# EAGLE design Röle Modülü Çift (EAGLE 9.6.2)
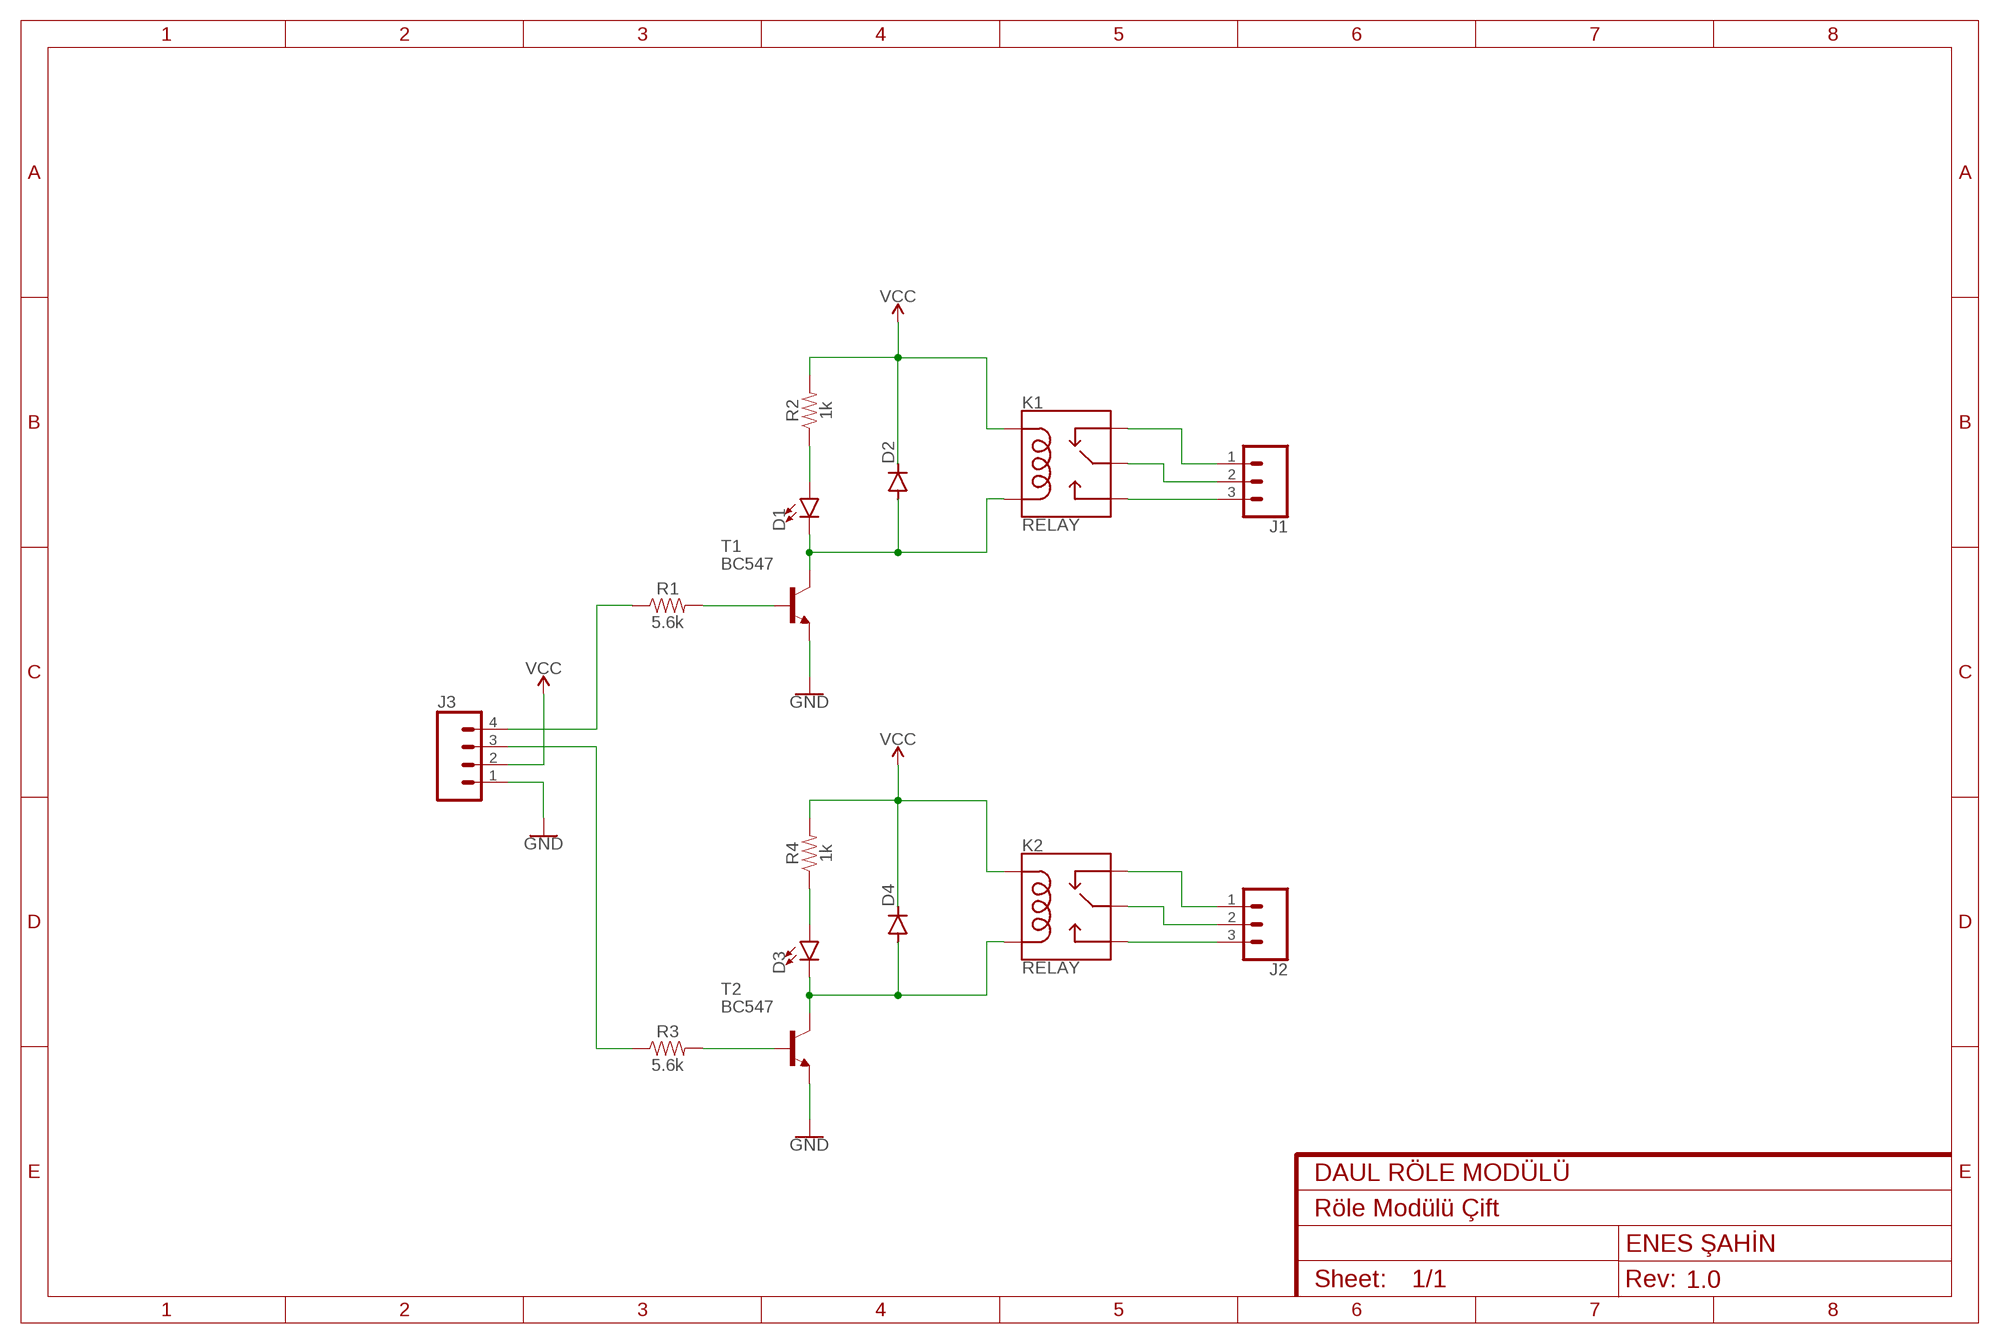
[diagram p0: schematic, sheet 1]
FRAME1 (FRAME-A4L): CNAME: DAUL RÖLE MODÜLÜ; CREVISION: 1.0; DESIGNER: ENES ŞAHİN

## Parts
D1  LED3MM  [LED_3MM]
D2  DIODE-DO07  [DO07]
D3  LED3MM  [LED_3MM]
D4  DIODE-DO07  [DO07]
J1  CONN_03  [1X03]
J2  CONN_03  [1X03]
J3  CONN_04  [1X04]
K1  RELAY  RELAY-SPDT-JZC-11F  [RELAY-JZC]
K2  RELAY  RELAY-SPDT-JZC-11F  [RELAY-JZC]
R1  5.6k  1KOHM-HORIZ-1/4W-1%  [AXIAL-0.3]
R2  1k  1KOHM-HORIZ-1/4W-1%  [AXIAL-0.3]
R3  5.6k  1KOHM-HORIZ-1/4W-1%  [AXIAL-0.3]
R4  1k  1KOHM-HORIZ-1/4W-1%  [AXIAL-0.3]
T1  BC547  [TO92]
T2  BC547  [TO92]

## Nets
GND: J3.1 T1.1(E) T2.1(E)
N$1: R1.P$2 T1.2(B)
N$2: D1.K(C) D2.A K1.1(COIL2) T1.3(C)
N$3: D1.A R2.P$1
N$4: R3.P$2 T2.2(B)
N$5: J3.4 R1.P$1
N$6: D3.K(C) D4.A K2.1(COIL2) T2.3(C)
N$7: J1.1 K1.2(NC)
N$8: J1.2 K1.4(MAIN)
N$9: J1.3 K1.3(NO)
N$10: D3.A R4.P$1
N$11: J3.3 R3.P$1
N$12: J2.1 K2.2(NC)
N$13: J2.2 K2.4(MAIN)
N$14: J2.3 K2.3(NO)
VCC: D2.C D4.C J3.2 K1.5(COIL1) K2.5(COIL1) R2.P$2 R4.P$2

## Library data of the parts
D1 D3 = SparkFun-LED1:LED: LED (Generic) Standard schematic elements and footprints for 5mm, 3mm, 1206, and 0603 sized LEDs. Generic LEDs with no color specified.; PROD_ID: DIO-08794
D2 D4 = diode:DIODE-: DIODE
J1 J2 = SparkFun-Connectors:CONN_03: Multi connection point. Often used as Generic Header-pin footprint for 0.1 inch spaced/style header connections On any of the 0.1 inch spaced packages, you can populate with these: Break Away Headers - Straight <https://www.sparkfun.com/products/116> (PRT-00116) Break Away Male Headers - Right Angle <https://www.sparkfun.com/products/553> (PRT-00553) Female Headers <https://www.sparkfun.com/products/115> (PRT-00115) Break Away Headers - Machine Pin <https://www.sparkfun.com/products/117> (PRT-00117) Break Away Female Headers - Swiss Machine Pin <https://www.sparkfun.com/products/743> (PRT-00743) Stackable Header - 3 Pin (Female, 0.1") <https://www.sparkfun.com/products/13875> (PRT-13875) For SCREWTERMINALS and SPRING TERMINALS visit here: Screw Terimnals on SparkFun.com <https://www.sparkfun.com/search/results?term=Screw+Terminals> (5mm/3.5mm/2.54mm spacing) This device is also useful as a general connection point to wire up your design to another part of your project. Our various solder wires solder well into these plated through hole pads. Hook-Up Wire - Assortment (Stranded, 22 AWG) <https://www.sparkfun.com/products/11375> (PRT-11375) Hook-Up Wire - Assortment (Solid Core, 22 AWG) <https://www.sparkfun.com/products/11367> (PRT-11367) View the entire wire category on our website here <https://www.sparkfun.com/categories/141> Special notes: Molex polarized connector foot print use with SKU : PRT-08232 with associated crimp pins and housings.
J3 = SparkFun-Connectors:CONN_04: Multi connection point. Often used as Generic Header-pin footprint for 0.1 inch spaced/style header connections On any of the 0.1 inch spaced packages, you can populate with these: Break Away Headers - Straight <https://www.sparkfun.com/products/116> (PRT-00116) Break Away Male Headers - Right Angle <https://www.sparkfun.com/products/553> (PRT-00553) Female Headers <https://www.sparkfun.com/products/115> (PRT-00115) Break Away Headers - Machine Pin <https://www.sparkfun.com/products/117> (PRT-00117) Break Away Female Headers - Swiss Machine Pin <https://www.sparkfun.com/products/743> (PRT-00743) For SCREWTERMINALS and SPRING TERMINALS visit here: Screw Terimnals on SparkFun.com <https://www.sparkfun.com/search/results?term=Screw+Terminals> (5mm/3.5mm/2.54mm spacing) This device is also useful as a general connection point to wire up your design to another part of your project. Our various solder wires solder well into these plated through hole pads. Hook-Up Wire - Assortment (Stranded, 22 AWG) <https://www.sparkfun.com/products/11375> (PRT-11375) Hook-Up Wire - Assortment (Solid Core, 22 AWG) <https://www.sparkfun.com/products/11367> (PRT-11367) View the entire wire category on our website here <https://www.sparkfun.com/categories/141> Special notes: Molex polarized connector foot print use with SKU : PRT-08231 with associated crimp pins and housings. 1MM SMD Version SKU: PRT-10208; PROD_ID: CONN-09696
K1 K2 = SparkFun-Electromechanical:RELAY-SPDT: SPDT Electromechanical Relay Single-pole, double-throw sealed relays. When current is applied to the coil, it throws a simple changeover switch, terminating the connection from the NC contact to ground and closing the NO contact. Use them to switch high voltage/high current devices. SparkFun Products JQX-15F: Relay SPDT Sealed - 20A <https://www.sparkfun.com/products/10924> (COM-10924) JZC-11F: Relay SPDT Sealed <https://www.sparkfun.com/products/100> (COM-00100); PROD_ID: COMP-09533; SF_SKU: COM-00100
R1 R3 = SparkFun-Resistors1:1KOHM: 1kΩ resistor A resistor is a passive two-terminal electrical component that implements electrical resistance as a circuit element. Resistors act to reduce current flow, and, at the same time, act to lower voltage levels within circuits. - Wikipedia; PROD_ID: RES-12182; VALUE: 1k
R2 R4 = SparkFun-Resistors1:1KOHM: 1kΩ resistor A resistor is a passive two-terminal electrical component that implements electrical resistance as a circuit element. Resistors act to reduce current flow, and, at the same time, act to lower voltage levels within circuits. - Wikipedia; PROD_ID: RES-12182
T1 T2 = transistor:BC547: NPN TRANSISTOR

## Board
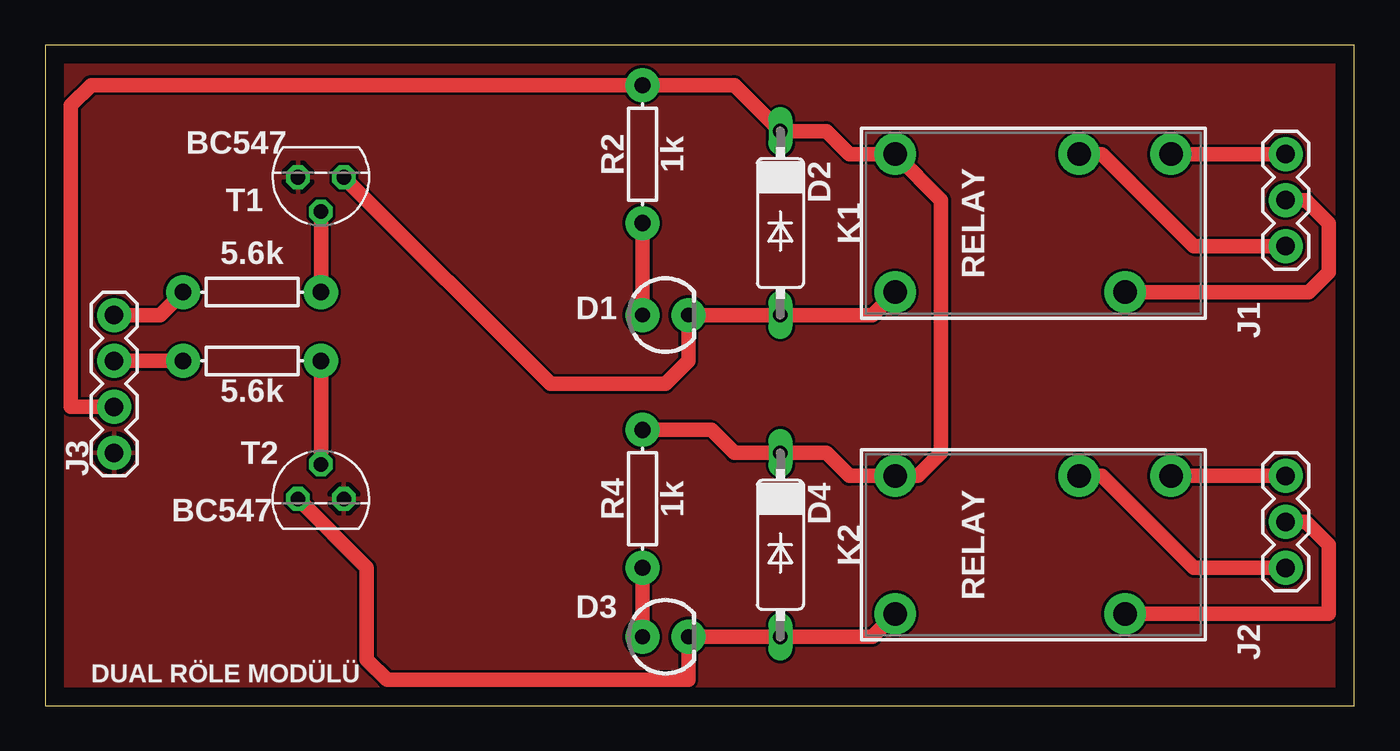
[diagram p1: board, top side]
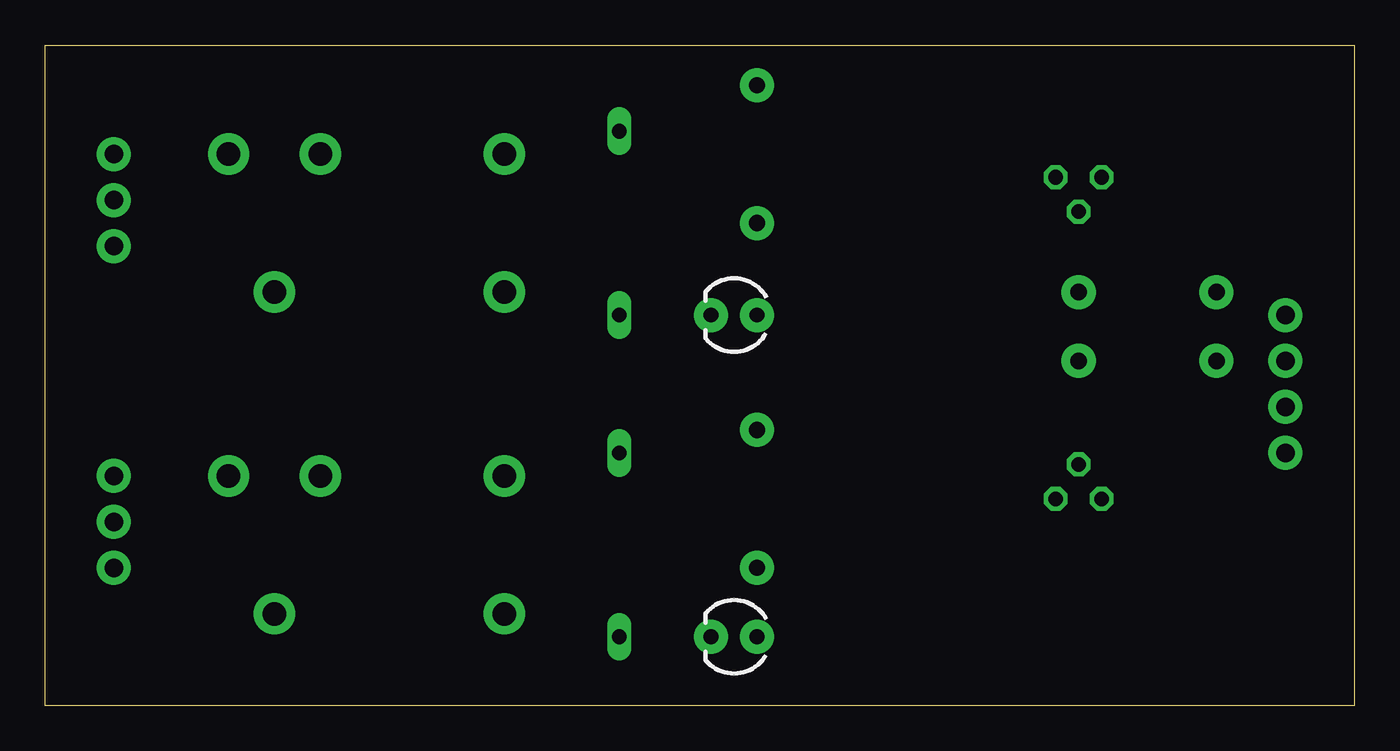
[diagram p2: board, bottom side, seen from below]

Size 72.37 x 36.5 mm. Coordinates in mm from the lower left corner, seen from the top.
Outline: 0,0 72.37,0 72.37,36.5 0,36.5 0,0
Copper layers (1*16): Top 0.035mm / dielectric 1.5mm / Bottom 0.035mm
Design rules "default": minimum track width 6mil, minimum drill 0.35mm, track to track 6mil, track to pad 6mil, pad to pad 6mil, via to via 6mil, smd to smd 6mil, copper to edge 40mil, drill to drill 6mil, minimum pad ring 10mil, minimum via ring 8mil, stop-mask expansion 4mil, vias tented up to drill 0mil, thermal gap 10mil

### Footprints (pad centres in the part's own frame; a part is rotated, then mirrored left to right if it is on the bottom)
LED_3MM = drill 0.813 pad 1.88: A -1.27,0; K 1.27,0
DO07 = drill 0.813 long: A 5.08,0; C -5.08,0
1X03 = drill 1.016 pad 1.88: 1 0,0; 2 2.54,0; 3 5.08,0
1X04 = drill 1.016 pad 1.88: 1 0,0; 2 2.54,0; 3 5.08,0; 4 7.62,0
RELAY-JZC = drill 1.3 pad 2.286: 1 3.81,-8.89; 2 -3.81,1.27; 3 -3.81,6.35; 4 3.81,3.81; 5 -3.81,-8.89
AXIAL-0.3 = drill 0.9 pad 1.88: P$1 -3.81,0; P$2 3.81,0
TO92 = drill 0.813 octagon: 1 1.27,0; 2 0,1.905; 3 -1.27,0

### Placement (x,y rotation side)
D1  34.29,21.59 0 top
D2  40.64,26.67 270 top
D3  34.29,3.81 0 top
D4  40.64,8.89 270 top
J1  68.58,25.4 90 top
J2  68.58,7.62 90 top
J3  3.81,13.97 90 top
K1  55.88,26.67 270 top
K2  55.88,8.89 270 top
R1  11.43,22.86 0 top
R2  33.02,30.48 90 top
R3  11.43,19.05 0 top
R4  33.02,11.43 90 top
T1  15.24,29.21 180 top
T2  15.24,11.43 0 top

### Tracks (layer width: path | path; a pad name or v marks a point on that pad's centre or on a via)
GND
  pour Top: -1.27,38.1 73.66,38.1 73.66,-1.27 -1.27,-1.27
N$1
  Top 0.813: R1.P$2 T1.2
N$2
  Top 0.813: K1.1 45.72,21.59 D2.A D1.K 35.56,19.05 34.29,17.78 27.94,17.78 T1.3
N$3
  Top 0.813: R2.P$1 D1.A
N$4
  Top 0.813: R3.P$2 T2.2
N$5
  Top 0.813: J3.4 6.35,21.59 R1.P$1
N$6
  Top 0.813: T2.3 17.78,7.62 17.78,2.54 18.9,1.42 35.56,1.42 D3.K D4.A 45.72,3.81 K2.1
N$7
  Top 0.813: K1.2 58.42,30.48 63.5,25.4 J1.1
N$8
  Top 0.813: K1.4 69.85,22.86 70.95,23.96 70.95,26.67 69.68,27.94 J1.2
N$9
  Top 0.813: K1.3 J1.3
N$10
  Top 0.813: D3.A R4.P$1
N$11
  Top 0.813: J3.3 R3.P$1
N$12
  Top 0.813: K2.2 58.42,12.7 63.5,7.62 J2.1
N$13
  Top 0.813: K2.4 70.95,5.08 70.95,8.89 69.68,10.16 J2.2
N$14
  Top 0.813: K2.3 J2.3
VCC
  Top 0.813: R4.P$2 36.83,15.24 38.1,13.97 D4.C 43.18,13.97 44.45,12.7 K2.5 48.26,12.7 49.53,13.97 49.53,27.94 K1.5 44.45,30.48 43.18,31.75 D2.C 38.1,34.29 R2.P$2 2.54,34.29 1.42,33.17 1.42,16.51 J3.2

### Text on the board
tNames: DUAL RÖLE MODÜLÜ